# EAGLE design Qwiic RGB Sensor - BH1749 (EAGLE 9.0.0)
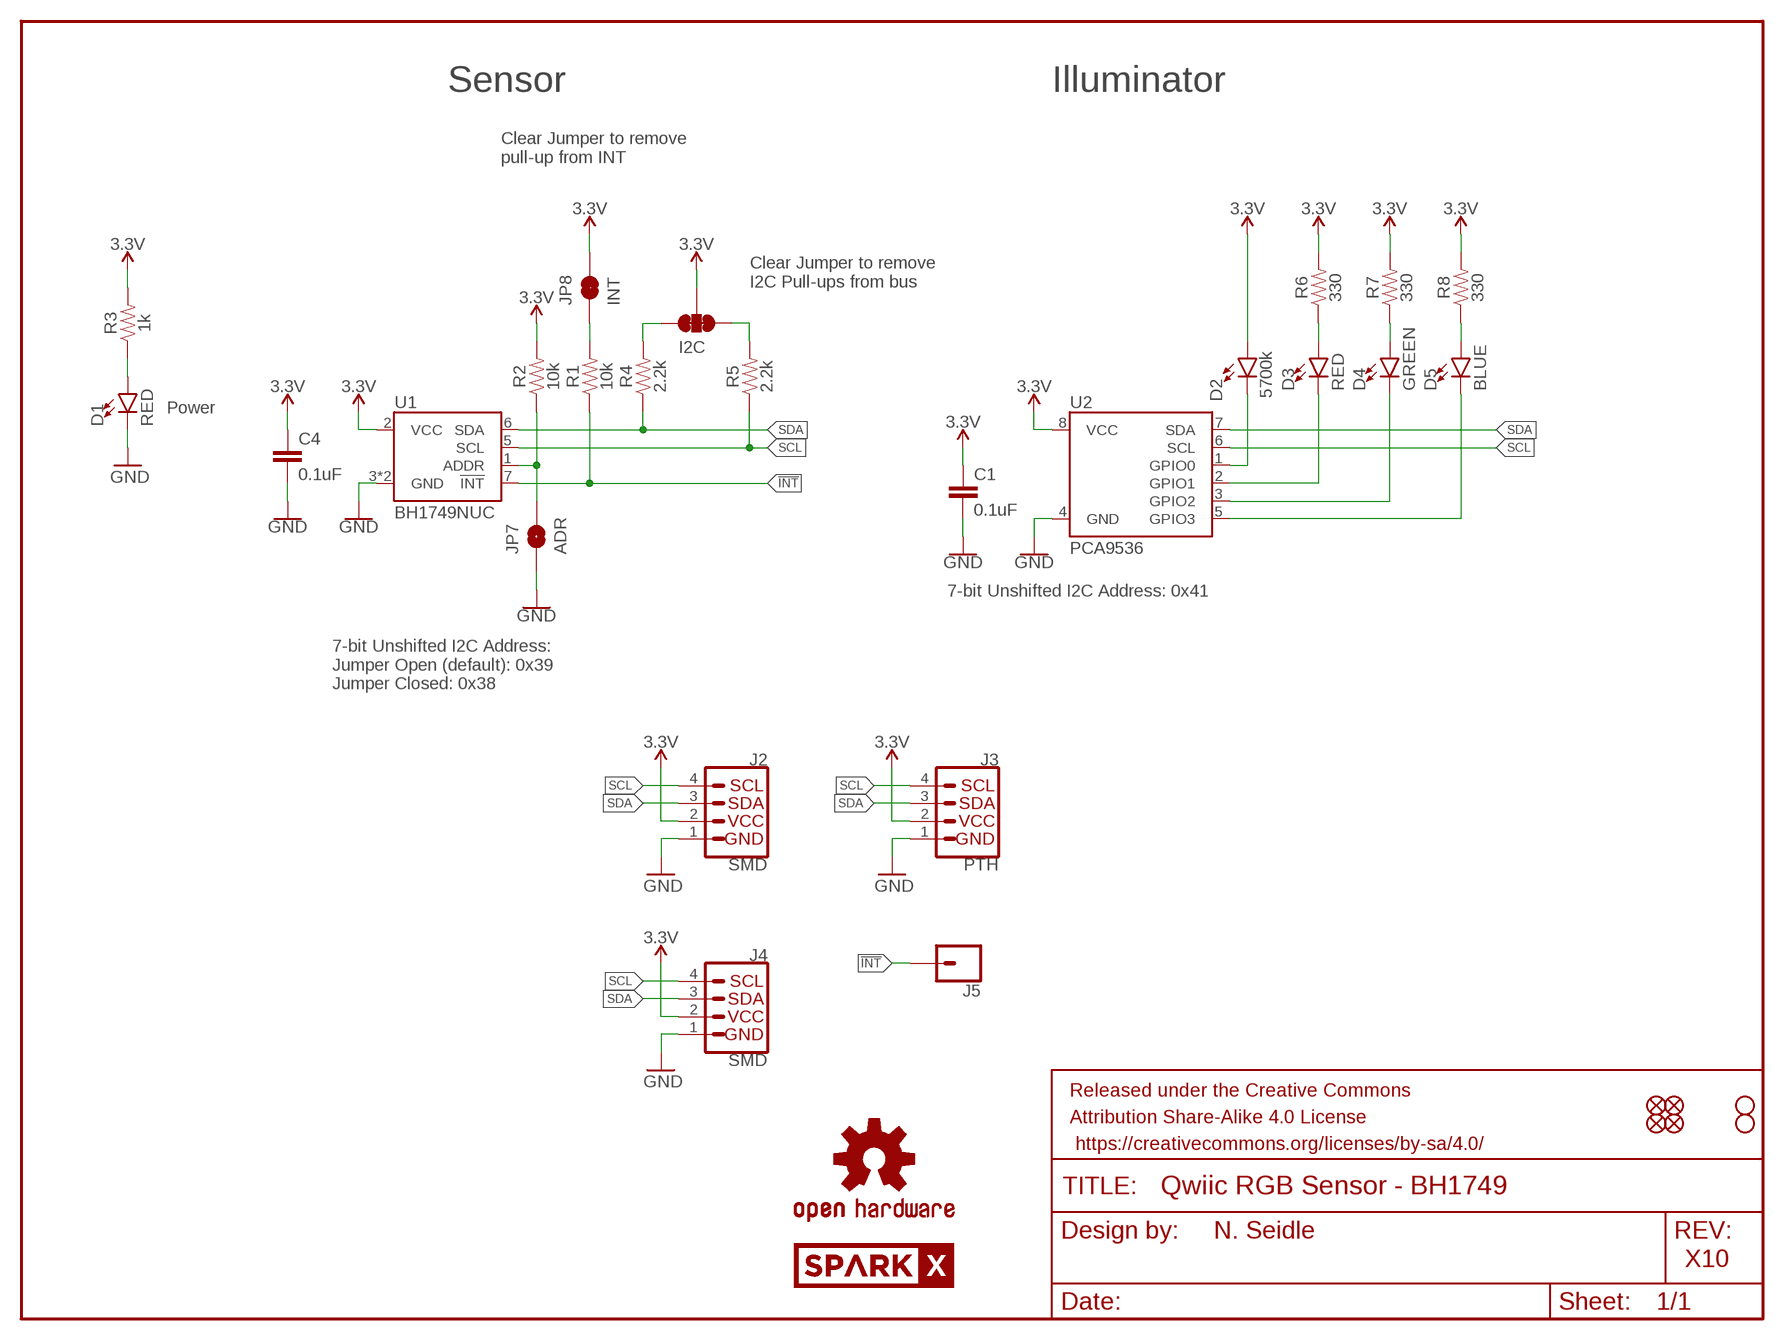
[diagram p0: schematic, sheet 1]

## Parts
C1  0.1uF  0.1UF-0603-25V-(+80/-20%)  [0603]
C4  0.1uF  0.1UF-0603-25V-(+80/-20%)  [0603]
D1  RED  LED-RED0603  [LED-0603]
D2  5700k  LEDLD  [SUPER_BRIGHT_SMD_LED_1206]
D3  RED  LED-RED0603  [LED-0603]
D4  GREEN  LED-GREEN0603  [LED-0603]
D5  BLUE  LED-BLUE0603  [LED-0603]
FRAME1  FRAME-LETTER  [CREATIVE_COMMONS]
I2C  JUMPER-SMT_3_2-NC_TRACE_SILK  [SMT-JUMPER_3_2-NC_TRACE_SILK]
J2  SMD  I2C_STANDARDJS-1MM  [1X04_1MM_RA]
J3  PTH  I2C_STANDARD_NO_SILK  [1X04_NO_SILK]
J4  SMD  I2C_STANDARDJS-1MM  [1X04_1MM_RA]
J5  CONN_01PTH_NO_SILK_YES_STOP  [1X01_NO_SILK]
JP1  FIDUCIALUFIDUCIAL  [MICRO-FIDUCIAL]
JP2  FIDUCIALUFIDUCIAL  [MICRO-FIDUCIAL]
JP3  STAND-OFF  [STAND-OFF]
JP4  STAND-OFF  [STAND-OFF]
JP5  FIDUCIALUFIDUCIAL  [MICRO-FIDUCIAL]
JP6  FIDUCIALUFIDUCIAL  [MICRO-FIDUCIAL]
JP7  ADR  JUMPER-SMT_2_NO_SILK  [SMT-JUMPER_2_NO_SILK]
JP8  INT  JUMPER-SMT_2_NC_TRACE_SILK  [SMT-JUMPER_2_NC_TRACE_SILK]
LOGO1  OSHW-LOGOMINI  [OSHW-LOGO-MINI]
R1  10k  10KOHM-0603-1/10W-1%  [0603]
R2  10k  10KOHM-0603-1/10W-1%  [0603]
R3  1k  1KOHM-0603-1/10W-1%  [0603]
R4  2.2k  2.2KOHM-0603-1/10W-1%  [0603]
R5  2.2k  2.2KOHM-0603-1/10W-1%  [0603]
R6  330  330OHM-0603-1/10W-1%  [0603]
R7  330  330OHM-0603-1/10W-1%  [0603]
R8  330  330OHM-0603-1/10W-1%  [0603]
U1  BH1749NUC  [BH1749NUC]
U2  PCA9536  [MSOP8]
U$1  SPARKX-LOGO4  [SPARKX-MEDIUM]
U$2  SPARKX-LOGO4  [SPARKX-MEDIUM]

## Nets
3.3V: C1.1 C4.1 D2.A I2C.2 J2.2(VCC) J3.2(VCC) J4.2(VCC) JP8.2 R2.2 R3.2 R6.2 R7.2 R8.2 U1.2(VCC) U2.8(VCC)
!INT: J5.1 R1.1 U1.7(!INT)
ADR: JP7.2 R2.1 U1.1(ADDR)
GND: C1.2 C4.2 D1.C J2.1(GND) J3.1(GND) J4.1(GND) JP7.1 U1.3(GND) U1.4(GND) U2.4(GND)
N$1: I2C.1 R5.2
N$2: I2C.3 R4.2
N$3: D1.A R3.1
N$4: JP8.1 R1.2
N$5: D3.C U2.2(GPIO1)
N$6: D4.C U2.3(GPIO2)
N$7: D5.C U2.5(GPIO3)
N$8: D3.A R6.1
N$9: D4.A R7.1
N$10: D2.C U2.1(GPIO0)
N$11: D5.A R8.1
SCL: J2.4(SCL) J3.4(SCL) J4.4(SCL) R5.1 U1.5(SCL) U2.6(SCL)
SDA: J2.3(SDA) J3.3(SDA) J4.3(SDA) R4.1 U1.6(SDA) U2.7(SDA)

## Notes on the sheet
- Sensor | Illuminator
- Clear Jumper to remove 
  pull-up from INT
- Clear Jumper to remove 
  I2C Pull-ups from bus
- Power
- 7-bit Unshifted I2C Address: 0x41
- 7-bit Unshifted I2C Address: 
  Jumper Open (default): 0x39
  Jumper Closed: 0x38
- N. Seidle
- X10

## Library data of the parts
C1 C4 = SparkFun-Capacitors:0.1UF: 0.1µF ceramic capacitors A capacitor is a passive two-terminal electrical component used to store electrical energy temporarily in an electric field.; PROD_ID: CAP-00810
D1 D3 = SparkFun-LED:LED-RED: Red SMD LED Used in manufacturing of most products at SparkFun Packages: 0603 - SMD 0603 package [Product Link] <http://docs.avagotech.com/docs/AV02-0551EN> 0603 SMART - SMD 0603 SMART package ( more efficient and expensive)[Product Link] <http://www.osram-os.com/Graphics/XPic2/00077099_0.pdf> 1206 - SMD1206 package [Product Link] <https://www.sparkfun.com/datasheets/DevTools/LilyPad/Q150OVS4.pdff> SparkFun Products: Pro Mini 328 -5V <https://www.sparkfun.com/products/821> RedBoard <https://www.sparkfun.com/products/12757> IOIO-OTG <https://www.sparkfun.com/products/13613>; PROD_ID: DIO-00819
D2 = SparkX:LED
D4 = SparkFun-LED:LED-GREEN: Green SMD LED Used in manufacturing of various products at SparkFun Packages: 0603 - SMD 0603 package [Product Link] <http://www.futureelectronics.com/en/technologies/semiconductors/optoelectronics/leds/Pages/9894312-LTST-C190GKT.aspx?CrossPart=HSMG-C190&IM=0> LilyPad 1206 - SMD1206 LilyPad package [Product Link] <http://www.futureelectronics.com/en/Technologies/Product.aspx?ProductID=IN150NGHARVATEKCORPORATION2049943&IM=0> 1206 - SMD1206 package [Product Link] <http://www.futureelectronics.com/en/technologies/semiconductors/optoelectronics/leds/Pages/8315665-LTST-C150KGKT.aspx?IM=0> 1206 Bottom Mount -SMD 1206 Bottom Mount [Product Link] <http://www.digikey.com/product-detail/en/lite-on-inc/LTST-C230KGKT/160-1456-1-ND/386854> SparkFun Products: Pro Mini 328 -5V <https://www.sparkfun.com/products/821> RedBoard <https://www.sparkfun.com/products/12757> MP3 Trigger <https://www.sparkfun.com/products/13720> Makey Makey <https://www.sparkfun.com/products/11076>; PROD_ID: DIO-00821
D5 = SparkFun-LED:LED-BLUE: Blue SMD LED Used in manufacturing of various products at SparkFun Packages: 0603 - SMD 0603 package [Product Link] <http://www.digikey.com/product-detail/en/SMLE12BC7TT86/511-1589-2-ND/1641808> 1206 - SMD1206 package [Product Link] <http://www.digikey.com/product-detail/en/lite-on-inc/LTST-C150TBKT/160-1643-1-ND/573584> SparkFun Products: ESP8266 Thing-Dev Board <https://www.sparkfun.com/products/13711> RedBoard <https://www.sparkfun.com/products/12757>; PROD_ID: DIO-08575
FRAME1 = SparkFun-Aesthetics:FRAME-LETTER: Schematic Frame - Letter Standard 8.5x11 US Letter frame
I2C = SparkFun-Jumpers:JUMPER-SMT_3_2-NC_TRACE: Normally closed trace jumper (2 of 2 connections) This jumper has a trace between all three pads so they are normally closed (NC). Use a razor knife to open the connection(s). For best results follow the IPC guidelines for cutting traces: Cutout at least 0.063 mm (0.005 in). Remove all loose material to clean up the cut area. Seal the cut with an approved epoxy. Reapply solder to reclose the connection(s).
J2-J4 = SparkX:I2C_STANDARD: SparkFun I2C Standard Pinout Header SparkFun has standardized on a pinout for all I2C based sensor breakouts. This pinout allows I2C boards to be plugged directly into the headers on Arduino Uno compatible boards, and to be daisy chained easily. Example SparkFun Products: SparkFun Atmospheric Sensor Breakout - BME280 <https://www.sparkfun.com/products/13676> SparkFun Altitude/Pressure Sensor Breakout - MPL3115A2 <https://www.sparkfun.com/products/11084> SparkFun TOF Range Finder Sensor - VL6180 <https://www.sparkfun.com/products/12785>
J5 = SparkFun-Connectors:CONN_01: Single connection point. Often used as Generic Header-pin footprint for 0.1 inch spaced/style header connections On any of the 0.1 inch spaced packages, you can populate with these: Break Away Headers - Straight <https://www.sparkfun.com/products/116> (PRT-00116) Break Away Male Headers - Right Angle <https://www.sparkfun.com/products/553> (PRT-00553) Female Headers <https://www.sparkfun.com/products/115> (PRT-00115) Break Away Headers - Machine Pin <https://www.sparkfun.com/products/117> (PRT-00117) Break Away Female Headers - Swiss Machine Pin <https://www.sparkfun.com/products/743> (PRT-00743) This device is also useful as a general connection point to wire up your design to another part of your project. Our various solder wires solder well into these plated through hole pads. Hook-Up Wire - Assortment (Stranded, 22 AWG) <https://www.sparkfun.com/products/11375> (PRT-11375) Hook-Up Wire - Assortment (Solid Core, 22 AWG) <https://www.sparkfun.com/products/11367> (PRT-11367) View the entire wire category on our website here <https://www.sparkfun.com/categories/141> Special notes: SMTSO-256-ET is a "flush mount" nut for a 4-40 screw. We mostly use this on specialty testbeds; it is a nice way to connect hardware to your PCB at an adjustable hieght. Also note, the SNAP packages are for using a snappable style connector. We sell a baggie of snaps and they are also used on two LilyPad designs: Snap Assortment - 30 pack (male and female) <https://www.sparkfun.com/products/11347> (DEV-11347) LilyPad Arduino SimpleSnap <https://www.sparkfun.com/products/10941> (DEV-10941) LilyPad SimpleSnap Protoboard <https://www.sparkfun.com/products/10940> (DEV-10940)
JP1 JP2 JP5 JP6 = SparkFun:FIDUCIAL: Fiducial Alignment Points Various fiducial points for machine vision alignment.
JP3 JP4 = SparkFun:STAND-OFF: Stand Off This is the mechanical footprint for a #4 phillips button head screw. Use the keepout ring to avoid running the screw head into surrounding components. SKU : PRT-00447
JP7 = SparkFun-Jumpers:JUMPER-SMT_2_NO: Normally open jumper This jumper has two pads in close proximity to each other. Apply solder to close the connection. Round pads are easier to solder for beginners, but are a lot larger. SparkFun Product that uses the round pads: SparkFun EL Sequencer <https://www.sparkfun.com/products/12781>
JP8 = SparkFun-Jumpers:JUMPER-SMT_2_NC_TRACE: Normally closed trace jumper This jumper has a trace between two pads so it's normally closed (NC). Use a razor knife to open the connection. For best results follow the IPC guidelines for cutting traces: Cutout at least 0.063 mm (0.005 in). Remove all loose material to clean up the cut area. Seal the cut with an approved epoxy. Reapply solder to reclose the connection.
LOGO1 = SparkFun-Aesthetics:OSHW-LOGO: Open-Source Hardware (OSHW) Logo This logo indicates the piece of hardware it is found on incorporates a OSHW license and/or adheres to the definition of open source hardware found here: http://freedomdefined.org/OSHW
R1 R2 = SparkFun-Resistors:10KOHM: 10kΩ resistor A resistor is a passive two-terminal electrical component that implements electrical resistance as a circuit element. Resistors act to reduce current flow, and, at the same time, act to lower voltage levels within circuits. - Wikipedia; PROD_ID: RES-00824
R3 = SparkFun-Resistors:1KOHM: 1kΩ resistor A resistor is a passive two-terminal electrical component that implements electrical resistance as a circuit element. Resistors act to reduce current flow, and, at the same time, act to lower voltage levels within circuits. - Wikipedia; PROD_ID: RES-07856
R4 R5 = SparkFun-Resistors:2.2KOHM: 2.2kΩ resistor A resistor is a passive two-terminal electrical component that implements electrical resistance as a circuit element. Resistors act to reduce current flow, and, at the same time, act to lower voltage levels within circuits. - Wikipedia; PROD_ID: RES-08272
R6-R8 = SparkFun-Resistors:330OHM: 330Ω resistor A resistor is a passive two-terminal electrical component that implements electrical resistance as a circuit element. Resistors act to reduce current flow, and, at the same time, act to lower voltage levels within circuits. - Wikipedia; PROD_ID: RES-00818
U1 = BH1749NUC:BH1749NUC
U2 = PCA9536:PCA9536
U$1 U$2 = SparkX:SPARKX-LOGO

## Net classes
1 power: width 0.203 mm

## Board
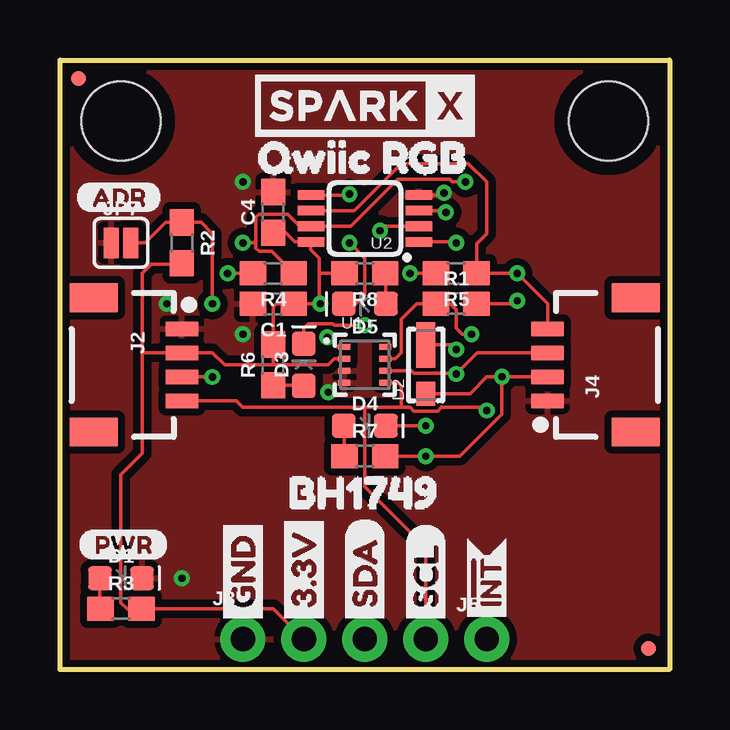
[diagram p1: board, top side]
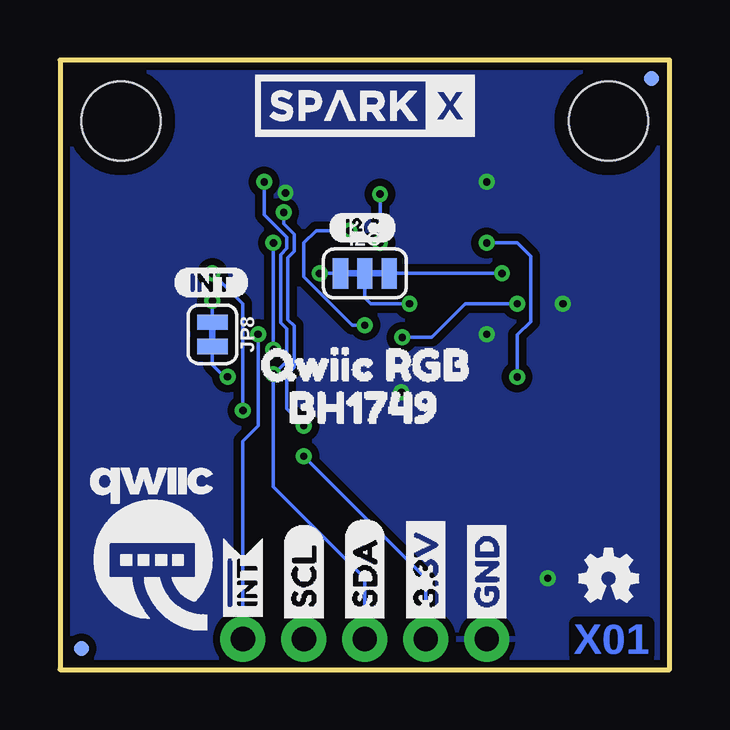
[diagram p2: board, bottom side, seen from below]

Size 25.4 x 25.4 mm. Coordinates in mm from the lower left corner, seen from the top.
Outline: 0,0 0,25.4 25.4,25.4 25.4,0 0,0
Copper layers (1*16): Top 0.035mm / dielectric 1.5mm / Bottom 0.035mm
Design rules "SparkFun-2-layer-PCBWay-LIMIT": minimum track width 6mil, minimum drill 0.3mm, track to track 6mil, track to pad 6mil, pad to pad 6mil, via to via 6mil, smd to smd 6mil, copper to edge 6mil, drill to drill 6mil, minimum pad ring 7mil, minimum via ring 7mil, stop-mask expansion 4mil, vias tented up to drill 25mil, thermal gap 10mil

### Footprints (pad centres in the part's own frame; a part is rotated, then mirrored left to right if it is on the bottom)
0603 = smd 1.1 x 1: 1 -0.85,0; 2 0.85,0
LED-0603 = smd 1 x 1: A -0.877,0; C 0.877,0
SUPER_BRIGHT_SMD_LED_1206 = smd 1 x 0.8: A -1.2,0 | smd 1.9 x 0.8: C 0.827,0
SMT-JUMPER_3_2-NC_TRACE_SILK = smd 0.635 x 1.27: 1 -1.016,0; 2 0,0; 3 1.016,0
1X04_1MM_RA = smd 0.6 x 1.35: 1 -1.5,0; 2 -0.5,0; 3 0.5,0; 4 1.5,0 | smd 1.2 x 2: NC1 2.8,-3.675; NC2 -2.8,-3.675
1X04_NO_SILK = drill 1.016 pad 1.88: 1 0,0; 2 2.54,0; 3 5.08,0; 4 7.62,0
1X01_NO_SILK = drill 1.016 pad 1.88: 1 0,0
MICRO-FIDUCIAL = smd 0.635 x 0.635: 1 0,0
STAND-OFF = hole 3.302: 0,0
SMT-JUMPER_2_NO_SILK = smd 0.635 x 1.27: 1 -0.406,0; 2 0.406,0
SMT-JUMPER_2_NC_TRACE_SILK = smd 0.635 x 1.27: 1 -0.508,0; 2 0.508,0
BH1749NUC = smd 0.5 x 0.25: 1 -0.85,0.75; 2 -0.85,0.25; 3 -0.85,-0.25; 4 -0.85,-0.75; 5 0.85,-0.75; 6 0.85,-0.25; 7 0.85,0.25; 8 0.85,0.75
MSOP8 = smd 1.1 x 0.4: 1 -2.25,0.975; 2 -2.25,0.325; 3 -2.25,-0.325; 4 -2.25,-0.975; 5 2.25,-0.975; 6 2.25,-0.325; 7 2.25,0.325; 8 2.25,0.975

### Placement (x,y rotation side)
C1  8.89,15.24 180 top
C4  8.89,19.05 90 top
D1  2.54,3.81 0 top
D2  15.24,12.7 90 top
D3  10.16,12.7 90 top
D4  12.7,10.16 0 top
D5  12.7,15.24 180 top
FRAME1  -20.32,-17.78 0 top  (outside the outline)
I2C  12.7,16.51 0 bottom
J2  5.08,12.7 270 top
J3  7.62,1.27 0 top
J4  20.32,12.7 90 top
J5  17.78,1.27 0 top
JP1  0.76,24.64 0 bottom
JP2  24.51,0.89 0 top
JP3  2.54,22.86 0 top
JP4  22.86,22.86 0 top
JP5  24.51,0.89 0 bottom
JP6  0.76,24.64 0 top
JP7  2.54,17.78 0 top
JP8  19.05,13.97 270 bottom
LOGO1  2.54,3.81 0 bottom
R1  16.51,15.24 0 top
R2  5.08,17.78 270 top
R3  2.54,2.54 0 top
R4  8.89,16.51 180 top
R5  16.51,16.51 180 top
R6  8.89,12.7 90 top
R7  12.7,8.89 0 top
R8  12.7,16.51 180 top
U1  12.7,12.7 0 top
U2  12.7,18.8 180 top
U$1  12.7,23.5 0 top
U$2  12.7,23.5 0 bottom
U$3  [GND1]  7.62,1.65 90 bottom
U$4  [3#3V2]  10.16,1.65 90 bottom
U$5  [SDA8]  12.7,1.65 90 bottom
U$6  [SCL9]  15.24,1.65 90 bottom
U$7  [INT#-[<]  17.78,1.52 90 bottom
U$8  [QWIIC-LOGO-MEDIUM]  21.59,5.08 0 bottom
U$9  [INT#-[<]  17.78,1.52 90 top
U$10  [I_SUPER2_C-()-03]  14.22,18.41 0 bottom
U$11  [BH17493]  17.02,10.92 0 bottom
U$12  [QWIIC_RGB2]  18.16,12.7 0 bottom
U$13  [BH17493]  8.38,7.37 0 top
U$16  [PWR-()-03]  0.76,5.21 0 top
U$17  [ADR-()-03]  0.64,19.68 0 top
U$20  [INT0]  20.7,16.13 0 bottom
U$21  [3#3V2]  10.16,1.65 90 top
U$22  [GND1]  7.62,1.65 90 top
U$24  [QWIIC_RGB2]  7.11,21.34 0 top
U$26  [SCL9]  15.24,1.65 90 top
U$27  [SDA8]  12.7,1.65 90 top

### Tracks (layer width: path | path; a pad name or v marks a point on that pad's centre or on a via)
3.3V  (via drill 0.3)
  Top 0.152: D2.A 17.09,11.5 17.79,12.2 v18.41,12.2 | J4.2 v18.41,12.2 | 8.89,12.7 6.86,12.7 6.35,13.21 6.34,13.2 J2.2 3.43,13.2 | 8.89,12.7 R6.2 8.89,15.11 9.02,15.24 C1.1 v10.84,15.24 10.79,15.29 10.79,16.51 | R8.2 10.79,16.51 | C4.1 9.4,18.2 9.78,17.82 U2.8 10.45,17.49 10.79,17.14 10.79,16.51 | R7.2 v15.24,8.89 16.66,8.89 18.41,10.64 v18.41,12.2 | 3.43,13.2 3.43,9.02 2.54,8.13 2.54,2.79 2.79,2.54 R3.2 8.89,2.54 J3.2 | U1.2 11.42,12.95 11.17,12.7 8.89,12.7 | 3.43,13.2 3.43,16.51 3.81,16.89 5.04,16.89 R2.2
  Bottom 0.152: v15.24,8.89 10.16,3.81 J3.2 | v10.84,15.24 12.45,15.24 12.7,15.49 I2C.2 | JP8.2 19.05,12.7 18.55,12.2 v18.41,12.2
!INT  (via drill 0.3)
  Top 0.152: U1.7 13.97,12.95 14.22,13.21 14.22,14.61 14.86,15.24 R1.1 16.26,15.24 16.51,14.99 16.51,14.22 16.76,13.97 v17.14,13.97
  Bottom 0.152: J5.1 17.78,9.53 17.14,10.16 v17.14,13.97
ADR  (via drill 0.3)
  Top 0.152: 11.84,13.46 U1.1 11.54,13.45 v11.14,13.84 | v6.35,15.24 6.35,18.16 5.88,18.63 R2.1 4.41,18.63 3.56,17.78 JP7.2
  Bottom 0.152: v6.35,15.24 8.51,15.24 9.91,13.84 v11.14,13.84
GND  (via drill 0.3)
  Top 0.152: U2.4 15.91,19.77 v16,19.86
  other vias: 11.18,11.56 7.62,13.97 4.45,15.24 7.62,20.32 5.08,3.81
  pour Bottom (isolate 0.305): 0,0 0,25.4 25.4,25.4 25.4,0
  pour Top (isolate 0.305): 0,0 0,25.4 25.4,25.4 25.4,0
N$1  (via drill 0.3)
  Top 0.152: v14.58,16.51 R5.2
  Bottom 0.152: I2C.1 v14.58,16.51
N$2  (via drill 0.3)
  Top 0.152: R4.2 v6.99,16.51
  Bottom 0.152: v6.99,16.51 I2C.3
N$3
  Top 0.152: D1.A 1.66,2.57 R3.1
N$4  (via drill 0.3)
  Top 0.152: R1.2 18.92,15.24 v19.05,15.37
  Bottom 0.152: v19.05,15.37 JP8.1
N$5  (via drill 0.3)
  Top 0.152: U2.2 13.52,18.47 v13.34,18.29 | D3.C 10.16,14.22 10.34,14.4 11.37,14.4 11.43,14.35 v12.7,14.35
  Bottom 0.152: v13.34,18.29 14.73,18.29 15.24,17.78 15.24,16.38 13.21,14.35 v12.7,14.35
N$6  (via drill 0.3)
  Top 0.152: D4.C v15.24,10.16 | U2.3 15.88,19.12 15.95,19.05 v16.08,19.05
  Bottom 0.152: v15.24,10.16 15.95,10.87 15.95,12.29 15.65,12.6 15.65,14.33 15.9,14.58 15.9,17.17 15.65,17.42 15.65,18.14 16.08,18.57 v16.08,19.05
N$7  (via drill 0.3)
  Top 0.152: D5.C 12.32,15.24 12.7,15.62 12.7,17.14 v12.06,17.78 | U2.5 12.02,19.77 v12.06,19.81
  Bottom 0.152: v12.06,17.78 v12.06,19.81
N$8
  Top 0.152: R6.1 10.13,11.85 D3.A
N$9
  Top 0.152: D4.A 11.85,10.13 R7.1
N$10  (via drill 0.3)
  Top 0.152: U2.1 16.47,17.82 v16.51,17.78 | v16.51,13.34 16.32,13.53 D2.C
  Bottom 0.152: v16.51,17.78 v16.51,13.34
N$11
  Top 0.152: R8.1 13.58,16.48 D5.A
SCL  (via drill 0.3)
  Top 0.152: J4.4 20.32,15.24 v19.05,16.51 R5.1 17.36,17.74 17.78,18.16 17.78,20.32 17.02,21.08 14.22,21.08 12.26,19.12 U2.6 | 12.7,10.92 12.7,7.62 15.24,5.08 J3.4 | J2.4 7.34,11.2 7.62,10.92 12.7,10.92 | v17.78,10.79 17.65,10.92 15.88,10.92 15.73,10.77 14.74,10.77 14.6,10.92 14.22,10.92 | 14.22,10.92 12.7,10.92 | U1.5 14.09,11.95 14.22,11.81 14.22,10.92
  Bottom 0.152: v19.05,16.51 17.78,15.24 v17.78,10.79
SDA  (via drill 0.3)
  Top 0.152: J4.3 17.39,13.2 v16.51,12.32 16.44,12.32 16.41,12.35 14.74,12.35 14.64,12.45 U1.6 | 8.16,17.78 8.16,17.55 8.29,17.42 8.83,17.42 R4.1 | 8.16,17.78 8.16,18.84 8.29,18.98 9.48,18.98 9.99,18.47 U2.7 12.12,18.47 14.07,20.42 16.23,20.42 16.34,20.32 v16.89,20.32 | v7.62,17.78 8.16,17.78 | J2.3 v6.34,12.2 v6.35,12.19
  Bottom 0.152: 16.51,12.29 v16.51,12.32 | 16.51,12.29 15.95,12.85 15.95,14.2 16.2,14.46 16.2,17.3 15.95,17.55 15.95,18.01 16.89,18.95 v16.89,20.32 | J3.3 12.7,3.81 16.51,7.62 16.51,12.29 | v6.35,12.19 6.35,13.94 5.79,14.5 5.79,17.22 6.35,17.78 v7.62,17.78

### Text on the board
Bottom: X01